# Altium schematic sheet MicroControlador.SchDoc
size A4; SheetNumber: 3; SheetTotal: 4; SPICEModelCacheTMNWFBLM: <root> / <DocumentId>TMNWFBLM</DocumentId> / </root>
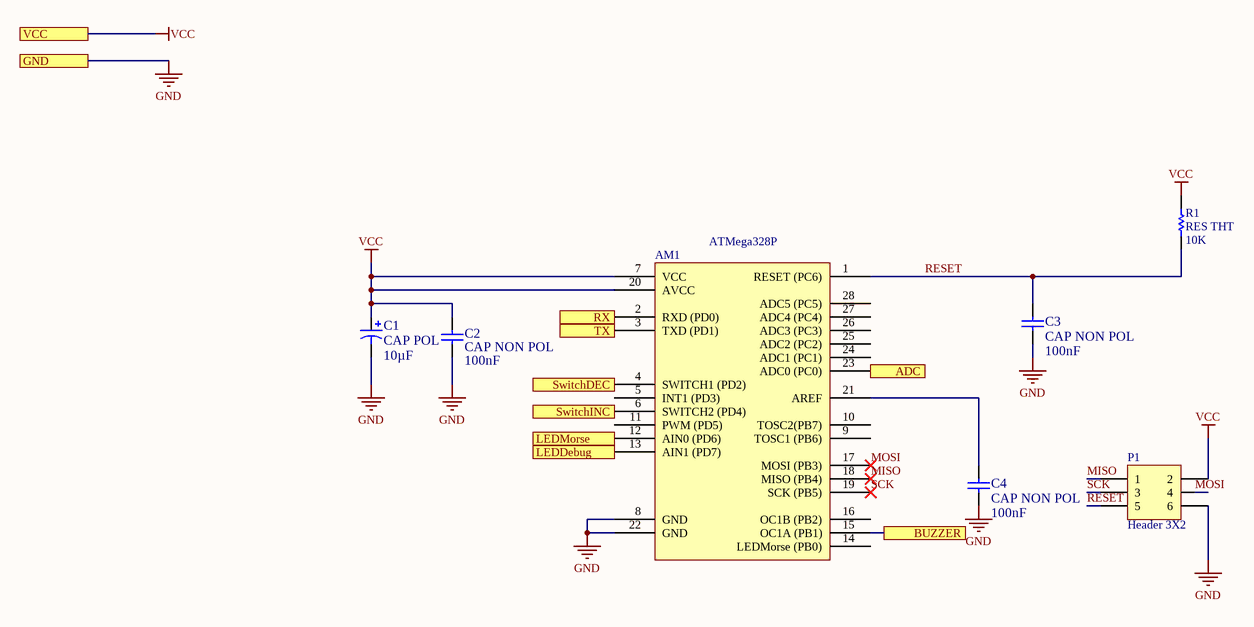
[diagram p0: MicroControlador.SchDoc]

## Parts
AM1  ATMega328P  [ATMega328P]
C1  CAP POL  value 10µF  [CONDENS 10uF]
C2  CAP NON POL  value 100nF  [Capacitor 100nF]
C3  CAP NON POL  value 100nF  [Capacitor 100nF]
C4  CAP NON POL  value 100nF  [Capacitor 100nF]
P1  Header 3X2  [Connector Header 3x2]
R1  RES THT  value 10K  [RESISTENCIA]

## Ports
ADC, BUZZER, GND, LEDDebug, LEDMorse, RX, SwitchDEC, SwitchINC, TX, VCC

## Nets
GND: AM1.8(GND) AM1.22(GND) C1.2 C2.2 C3.1 C4.1 P1.6 ; port GND
VCC: AM1.7(VCC) AM1.20(AVCC) C1.1 C2.1 P1.2 R1.2 ; port VCC
ADC: AM1.23(ADC0_(PC0)) ; port ADC
BUZZER: AM1.15(OC1A_(PB1)) ; port BUZZER
LEDDebug: AM1.13(AIN1_(PD7)) ; port LEDDebug
LEDMorse: AM1.12(AIN0_(PD6)) ; port LEDMorse
MISO: AM1.18(MISO_(PB4)) P1.1
MOSI: AM1.17(MOSI_(PB3)) P1.4
RESET: AM1.1(RESET_(PC6)) C3.2 P1.5 R1.1
RX: AM1.2(RXD_(PD0)) ; port RX
SCK: AM1.19(SCK_(PB5)) P1.3
SwitchDEC: AM1.4(SWITCH1_(PD2)) ; port SwitchDEC
SwitchINC: AM1.6(SWITCH2_(PD4)) ; port SwitchINC
TX: AM1.3(TXD_(PD1)) ; port TX
NetAM1_21: AM1.21(AREF) C4.2

Not connected (* = marked no-connect by the designer): AM1 5(INT1_(PD3)) 9(TOSC1_(PB6)) 10(TOSC2(PB7)) 11(PWM_(PD5)) 14(LEDMorse_(PB0)) 16(OC1B_(PB2)) 24(ADC1_(PC1)) 25(ADC2_(PC2)) 26(ADC3_(PC3)) 27(ADC4_(PC4)) 28(ADC5_(PC5))

## Library data of the parts
C1 = Cap Pol2: Polarized Capacitor (Axial); Published: 8-Jun-2000; LatestRevisionDate: 17-Jul-2002; LatestRevisionNote: Re-released for DXP Platform.; PackageReference: POLAR0.8; Publisher: Altium Limited; PackageDescription: Polarized Capacitor; 2 Leads
C2-C4 = Cap: Capacitor; Published: 8-Jun-2000; LatestRevisionDate: 17-Jul-2002; LatestRevisionNote: Re-released for DXP Platform.; PackageReference: RAD-0.3; Publisher: Altium Limited; PackageDescription: Radial Cap, Thru-Hole; 2 Leads; 0.3 in Pin Spacing
P1 = Header 3X2: Header, 3-Pin, Dual row; LatestRevisionDate: 17-Jul-2002; LatestRevisionNote: Re-released for DXP Platform.; Publisher: Altium Limited
R1 = Res1: Resistor; Published: 8-Jun-2000; LatestRevisionDate: 17-Jul-2002; LatestRevisionNote: Re-released for DXP Platform.; PackageReference: AXIAL-0.3; Publisher: Altium Limited; PackageDescription: Axial Device, Thru-Hole; 2 Leads; 0.3 in Pin Spacing